# EAGLE schematic BUZZI-19c (EAGLE 4.15)

## Sheet 1 of 8
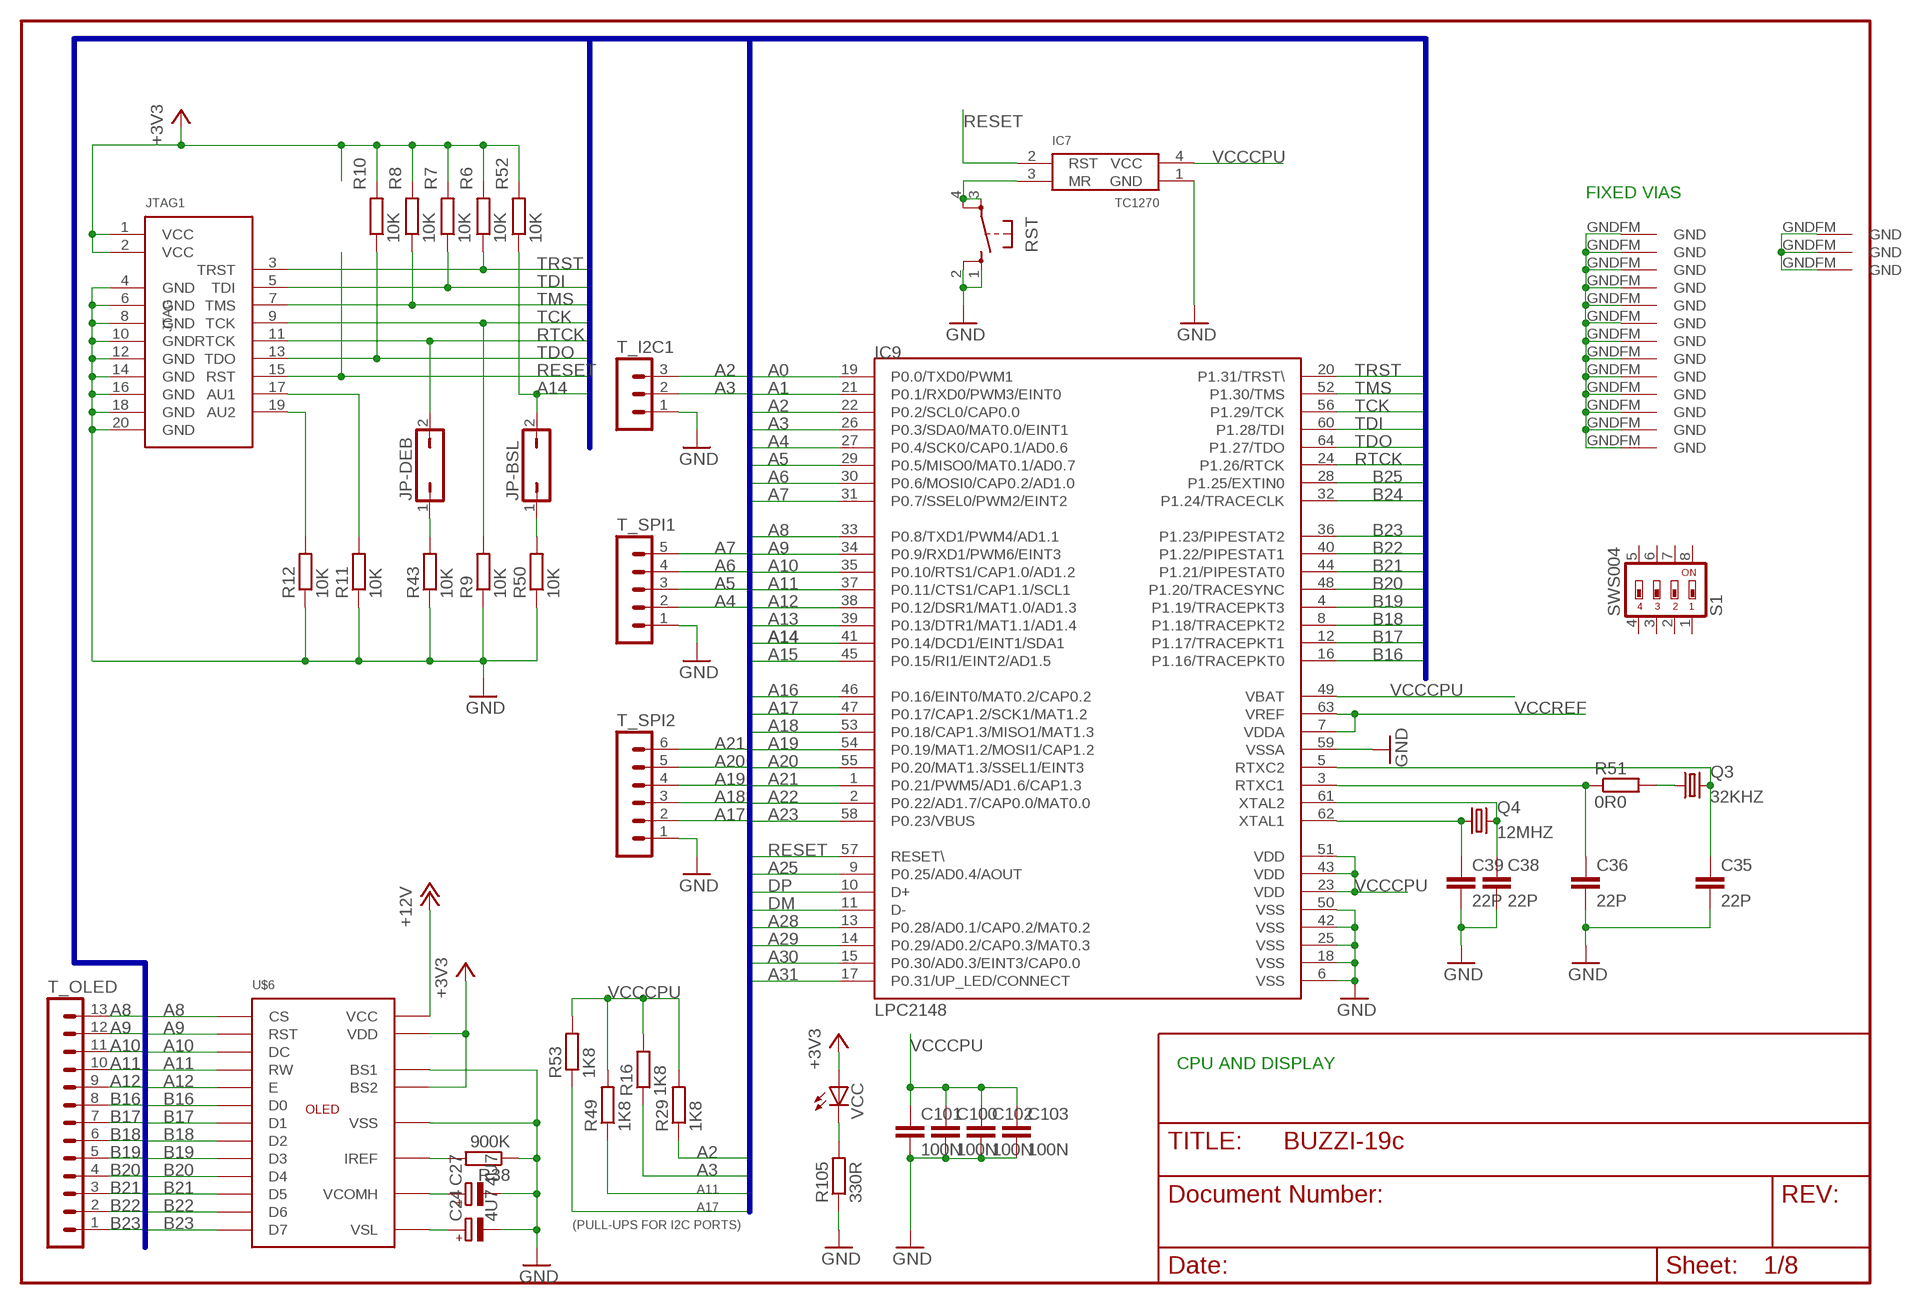
[diagram p0: schematic, sheet 1]

### Parts
$$U$9  STITCHVIA  [STITCHVIA]
$$U$11  STITCHVIA  [STITCHVIA]
C24  4U7  CPOL-EUCT3528  [CT3528]
C27  4U7  CPOL-EUCT3528  [CT3528]
C35  22P  C-EUC0805  [C0805]
C36  22P  C-EUC0805  [C0805]
C38  22P  C-EUC0805  [C0805]
C39  22P  C-EUC0805  [C0805]
C100  100N  C-EUC0805  [C0805]
C101  100N  C-EUC0805  [C0805]
C102  100N  C-EUC0805  [C0805]
C103  100N  C-EUC0805  [C0805]
IC7  TC1270  [SOT143R_INFINEON]
IC9  LPC2148  LPC2148FBD64  [TSQFP50P1200X1200X160-64N]
JP-BSL  JP1Q  [JP1]
JP-DEB  JP1Q  [JP1]
JTAG1  ARM-JTAG  [ML20L]
Q3  32KHZ  CRYTALTC26V  [TC26V]
Q4  12MHZ  CRYTALHC49UP  [HC49UP]
R6  10K  R-EU_M0805  [M0805]
R7  10K  R-EU_M0805  [M0805]
R8  10K  R-EU_M0805  [M0805]
R9  10K  R-EU_M0805  [M0805]
R10  10K  R-EU_M0805  [M0805]
R11  10K  R-EU_M0805  [M0805]
R12  10K  R-EU_M0805  [M0805]
R16  1K8  R-EU_M0805  [M0805]
R29  1K8  R-EU_M0805  [M0805]
R38  900K  R-EU_M0805  [M0805]
R43  10K  R-EU_M0805  [M0805]
R49  1K8  R-EU_M0805  [M0805]
R50  10K  R-EU_M0805  [M0805]
R51  0R0  R-EU_M0805  [M0805]
R52  10K  R-EU_M0805  [M0805]
R53  1K8  R-EU_M0805  [M0805]
R105  330R  R-EU_M0805  [M0805]
RST  10XX  [B3F-10XX]
S1  SWS004  [SMS-004]
T_I2C1  MA03-1  [MA03-1]
T_OLED  MA13-1  [MA13-1]
T_SPI1  MA05-1  [MA05-1]
T_SPI2  MA06-1  [MA06-1]
U$3  STITCHVIA  [STITCHVIA]
U$4  STITCHVIA  [STITCHVIA]
U$5  STITCHVIA  [STITCHVIA]
U$6  OLED_CALGARY_2  [OLED_CALGARY_INST]
U$7  STITCHVIA  [STITCHVIA]
U$8  STITCHVIA  [STITCHVIA]
U$10  STITCHVIA  [STITCHVIA]
U$12  STITCHVIA  [STITCHVIA]
U$13  STITCHVIA  [STITCHVIA]
U$14  STITCHVIA  [STITCHVIA]
U$15  STITCHVIA  [STITCHVIA]
U$16  STITCHVIA  [STITCHVIA]
U$17  STITCHVIA  [STITCHVIA]
U$18  STITCHVIA  [STITCHVIA]
U$19  STITCHVIA  [STITCHVIA]
VCC  LEDCHIP-LED0805  [CHIP-LED0805]

### Nets
+3V3: JTAG1.1(VCC) JTAG1.2(VCC) R6.2 R7.2 R8.2 R10.2 R52.2 U$6.P$19(BS2) U$6.P$21(VDD) VCC.A ; also sheet 2,5,7,8
+12V: U$6.P$2(VCC)
A0: IC9.19(P0.0/TXD0/PWM1)
A1: IC9.21(P0.1/RXD0/PWM3/EINT0) ; also sheet 4,7
A2: IC9.22(P0.2/SCL0/CAP0.0) R29.1 T_I2C1.3 ; also sheet 4,7
A3: IC9.26(P0.3/SDA0/MAT0.0/EINT1) R16.1 T_I2C1.2 ; also sheet 4,7
A4: IC9.27(P0.4/SCK0/CAP0.1/AD0.6) T_SPI1.2 ; also sheet 5,6
A5: IC9.29(P0.5/MISO0/MAT0.1/AD0.7) T_SPI1.3 ; also sheet 5,6
A6: IC9.30(P0.6/MOSI0/CAP0.2/AD1.0) T_SPI1.4 ; also sheet 5,6
A7: IC9.31(P0.7/SSEL0/PWM2/EINT2) T_SPI1.5 ; also sheet 5
A8: IC9.33(P0.8/TXD1/PWM4/AD1.1) T_OLED.13 U$6.P$17(CS)
A9: IC9.34(P0.9/RXD1/PWM6/EINT3) T_OLED.12 U$6.P$16(RST)
A10: IC9.35(P0.10/RTS1/CAP1.0/AD1.2) T_OLED.11 U$6.P$15(DC)
A11: IC9.37(P0.11/CTS1/CAP1.1/SCL1) R49.1 T_OLED.10 U$6.P$14(RW)
A12: IC9.38(P0.12/DSR1/MAT1.0/AD1.3) T_OLED.9 U$6.P$13(E)
A13: IC9.39(P0.13/DTR1/MAT1.1/AD1.4)
A14: IC9.41(P0.14/DCD1/EINT1/SDA1) JP-BSL.2 R52.1
A15: IC9.45(P0.15/RI1/EINT2/AD1.5) ; also sheet 6
A16: IC9.46(P0.16/EINT0/MAT0.2/CAP0.2) ; also sheet 4
A17: IC9.47(P0.17/CAP1.2/SCK1/MAT1.2) R53.1 T_SPI2.2 ; also sheet 4
A18: IC9.53(P0.18/CAP1.3/MISO1/MAT1.3) T_SPI2.3 ; also sheet 4
A19: IC9.54(P0.19/MAT1.2/MOSI1/CAP1.2) T_SPI2.4 ; also sheet 4
A20: IC9.55(P0.20/MAT1.3/SSEL1/EINT3) T_SPI2.5 ; also sheet 4
A21: IC9.1(P0.21/PWM5/AD1.6/CAP1.3) T_SPI2.6 ; also sheet 4
A22: IC9.2(P0.22/AD1.7/CAP0.0/MAT0.0)
A23: IC9.58(P0.23/VBUS) ; also sheet 2
A25: IC9.9(P0.25/AD0.4/AOUT)
A28: IC9.13(P0.28/AD0.1/CAP0.2/MAT0.2) ; also sheet 4
A29: IC9.14(P0.29/AD0.2/CAP0.3/MAT0.3) ; also sheet 4
A30: IC9.15(P0.30/AD0.3/EINT3/CAP0.0) ; also sheet 4
A31: IC9.17(P0.31/UP_LED/CONNECT) ; also sheet 2
B16: IC9.16(P1.16/TRACEPKT0) T_OLED.8 U$6.P$12(D0)
B17: IC9.12(P1.17/TRACEPKT1) T_OLED.7 U$6.P$11(D1)
B18: IC9.8(P1.18/TRACEPKT2) T_OLED.6 U$6.P$10(D2)
B19: IC9.4(P1.19/TRACEPKT3) T_OLED.5 U$6.P$9(D3)
B20: IC9.48(P1.20/TRACESYNC) T_OLED.4 U$6.P$8(D4)
B21: IC9.44(P1.21/PIPESTAT0) T_OLED.3 U$6.P$7(D5)
B22: IC9.40(P1.22/PIPESTAT1) T_OLED.2 U$6.P$6(D6)
B23: IC9.36(P1.23/PIPESTAT2) T_OLED.1 U$6.P$5(D7)
B24: IC9.32(P1.24/TRACECLK)
B25: IC9.28(P1.25/EXTIN0)
DM: IC9.11(D-) ; also sheet 2
DP: IC9.10(D+) ; also sheet 2
GND: C24.- C27.- C35.2 C36.2 C38.2 C39.2 C100.2 C101.2 C102.2 C103.2 IC7.1(GND) IC9.6(VSS) IC9.18(VSS) IC9.25(VSS) IC9.42(VSS) IC9.50(VSS) IC9.59(VSSA) JTAG1.4(GND) JTAG1.6(GND) JTAG1.8(GND) JTAG1.10(GND) JTAG1.12(GND) JTAG1.14(GND) JTAG1.16(GND) JTAG1.18(GND) JTAG1.20(GND) R9.1 R11.1 R12.1 R38.1 R43.1 R50.1 R105.1 RST.1 RST.2 T_I2C1.1 T_SPI1.1 T_SPI2.1 U$5.GNDFM(GND) U$6.P$20(BS1) U$6.P$29(VSS) U$7.GNDFM(GND) U$17.GNDFM(GND) ; also sheet 2,5,6,7,8
GNDFM: $$U$9.GNDFM(GND) $$U$11.GNDFM(GND) U$3.GNDFM(GND) U$4.GNDFM(GND) U$8.GNDFM(GND) U$10.GNDFM(GND) U$12.GNDFM(GND) U$13.GNDFM(GND) U$14.GNDFM(GND) U$15.GNDFM(GND) U$16.GNDFM(GND) U$18.GNDFM(GND) U$19.GNDFM(GND) ; also sheet 4,8
JBSL: JP-BSL.1 R50.2
JDEB: JP-DEB.1 R43.2
JTAG17: JTAG1.17(AU1) R11.2
JTAG19: JTAG1.19(AU2) R12.2
MRSWITCH: IC7.3(MR) RST.3 RST.4
N$44: R38.2 U$6.P$4(IREF)
N$45: C27.+ U$6.P$3(VCOMH)
N$46: C24.+ U$6.P$30(VSL)
RESET: IC7.2(RST) IC9.57(RESET\) JTAG1.15(RST)
RTCK: IC9.24(P1.26/RTCK) JP-DEB.2 JTAG1.11(RTCK)
RX1: C36.1 IC9.3(RTXC1) R51.1
RX2: C35.1 IC9.5(RTXC2) Q3.2
RX3: Q3.1 R51.2
TCK: IC9.56(P1.29/TCK) JTAG1.9(TCK) R9.2
TDI: IC9.60(P1.28/TDI) JTAG1.5(TDI) R7.1
TDO: IC9.64(P1.27/TDO) JTAG1.13(TDO) R10.1
TMS: IC9.52(P1.30/TMS) JTAG1.7(TMS) R8.1
TRST: IC9.20(P1.31/TRST\) JTAG1.3(TRST) R6.1
VCCCPU: C100.1 C101.1 C102.1 C103.1 IC7.4(VCC) IC9.23(VDD) IC9.43(VDD) IC9.49(VBAT) IC9.51(VDD) R16.2 R29.2 R49.2 R53.2 ; also sheet 8
VCCLED: R105.2 VCC.C
VCCREF: IC9.7(VDDA) IC9.63(VREF) ; also sheet 8
X1: C39.1 IC9.62(XTAL1) Q4.1
X2: C38.1 IC9.61(XTAL2) Q4.2
Unconnected: S1.1 S1.2 S1.3 S1.4 S1.5 S1.6 S1.7 S1.8

### Buses
ARM7:A[0..31],B[0..31],RESET,DP,DM,TRST,TMS,TCK,TDI,TDO,RTCK

### Notes on the sheet
- FIXED VIAS
- CPU AND DISPLAY
- (PULL-UPS FOR I2C PORTS)

## Sheet 2 of 8
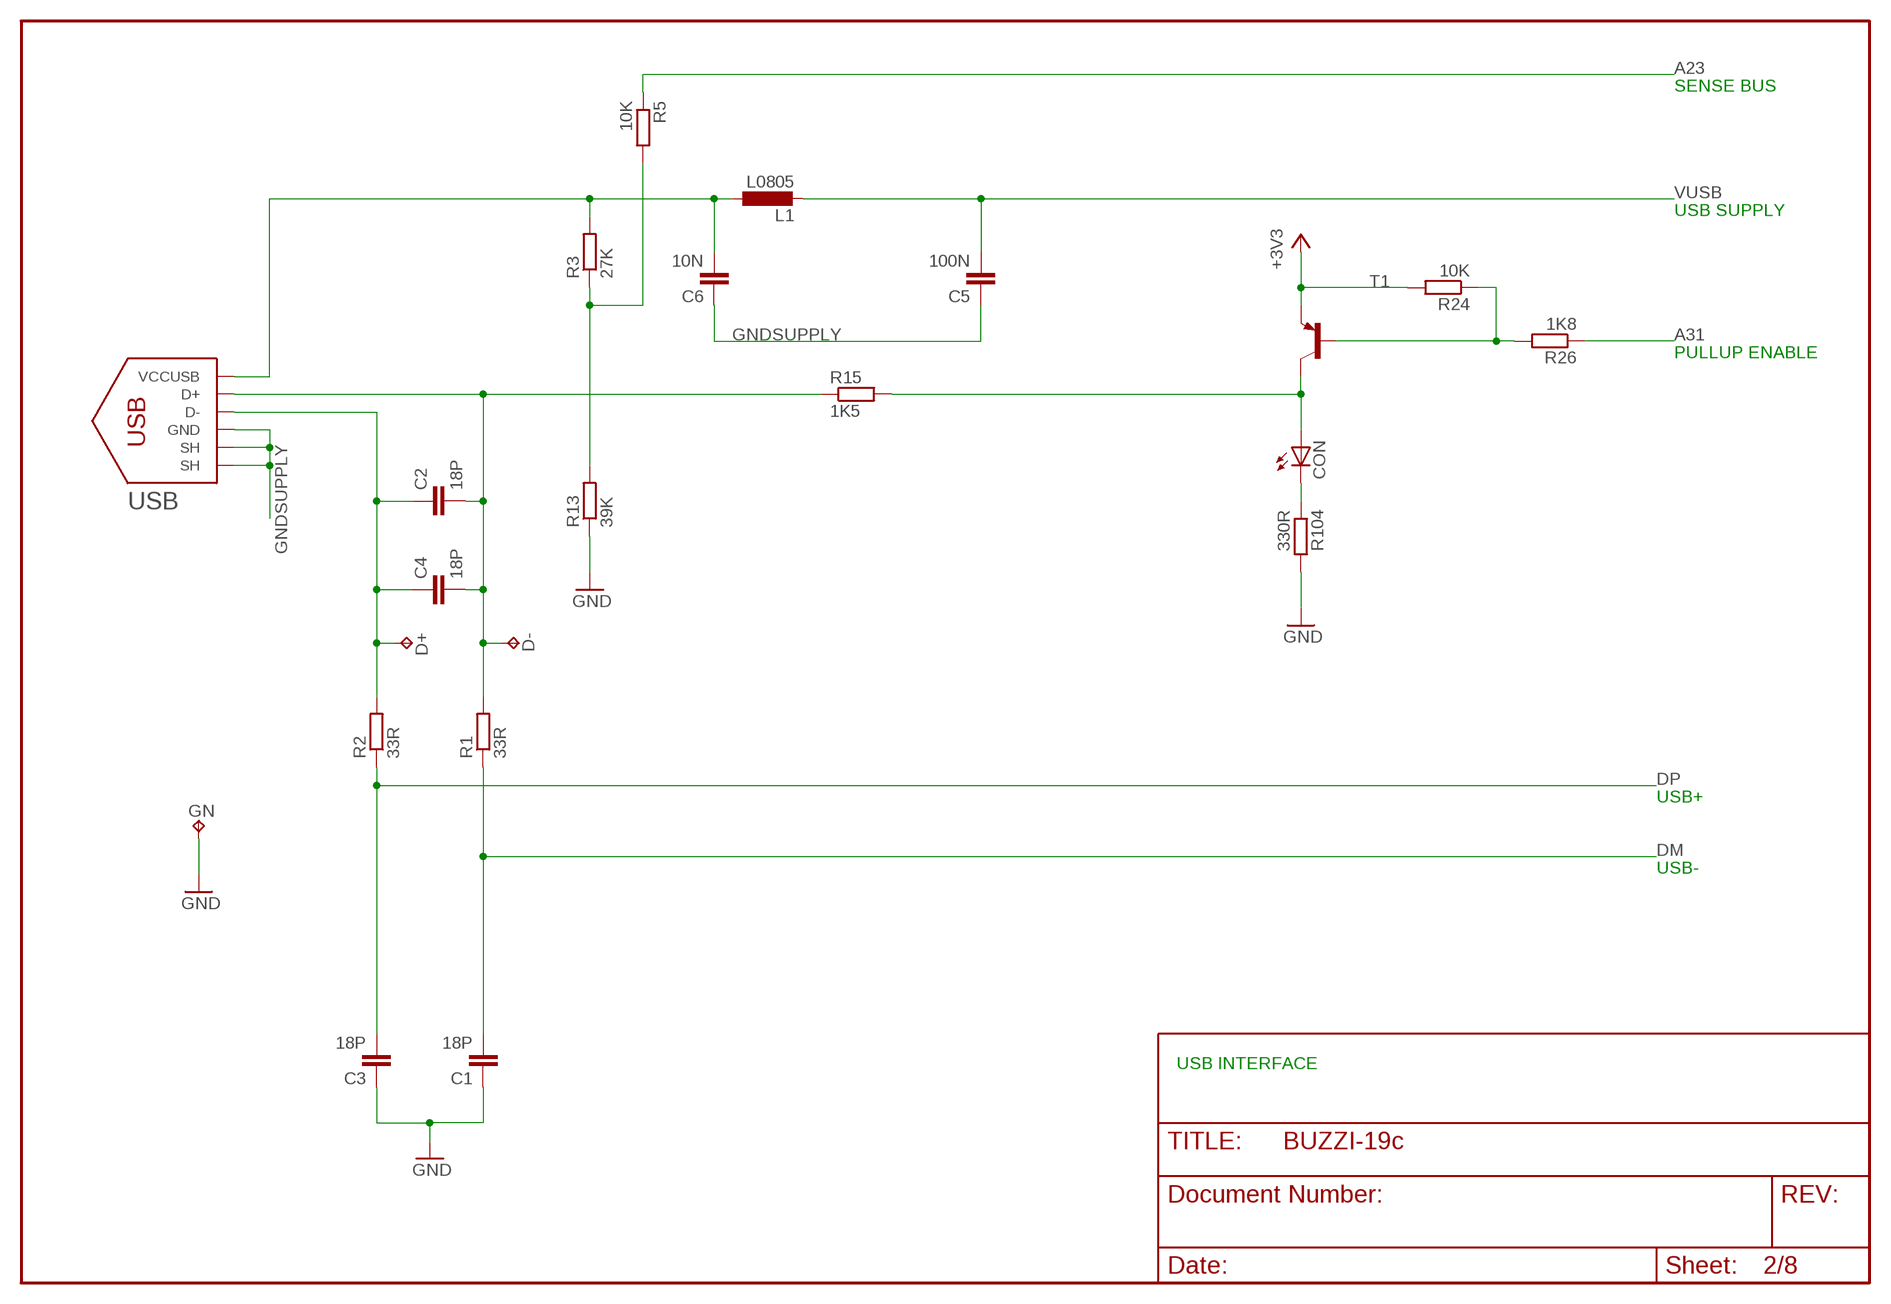
[diagram p1: schematic, sheet 2]

### Parts
C1  18P  C-EUC0805  [C0805]
C2  18P  C-EUC0805  [C0805]
C3  18P  C-EUC0805  [C0805]
C4  18P  C-EUC0805  [C0805]
C5  100N  C-EUC0805  [C0805]
C6  10N  C-EUC0805  [C0805]
CON  LEDCHIP-LED0805  [CHIP-LED0805]
D+  TPPAD1-13  [P1-13]
D-  TPPAD1-13  [P1-13]
GN  TPPAD1-13  [P1-13]
L1  L0805  [C0805]
R1  33R  R-EU_M0805  [M0805]
R2  33R  R-EU_M0805  [M0805]
R3  27K  R-EU_M0805  [M0805]
R5  10K  R-EU_M0805  [M0805]
R13  39K  R-EU_M0805  [M0805]
R15  1K5  R-EU_M0805  [M0805]
R24  10K  R-EU_M0805  [M0805]
R26  1K8  R-EU_M0805  [M0805]
R104  330R  R-EU_M0805  [M0805]
T1  BC857A-PNP-SOT23-BEC  [SOT23-BEC]
USB  USBCONNMINI-B-HOLE  [USB-MB-H]

### Nets
+3V3: R24.2 T1.E ; also sheet 1,5,7,8
A23: R5.1 ; also sheet 1
A31: R26.1 ; also sheet 1
CONLED: CON.C R104.1
D+: C2.1 C4.1 D+.1(TP) R2.2 USB.D-
D+PULLUP1: CON.A R15.2 T1.C
D+PULLUP2: R24.1 R26.2 T1.B
D-: C2.2 C4.2 D-.1(TP) R1.2 R15.1 USB.D+
DM: C1.2 R1.1 ; also sheet 1
DP: C3.2 R2.1 ; also sheet 1
GND: C1.1 C3.1 GN.1(TP) R13.1 R104.2 ; also sheet 1,5,6,7,8
GNDSUPPLY [supply]: C5.1 C6.1 USB.GND USB.GND@1(SH) USB.GND@2(SH) ; also sheet 8
USBSENSE: R3.1 R5.2 R13.2
VCCUSB1 [supply]: C6.2 L1.1 R3.2 USB.VBUS(VCCUSB)
VUSB [supply]: C5.2 L1.2 ; also sheet 8

### Notes on the sheet
- SENSE BUS
- USB SUPPLY
- PULLUP ENABLE
- USB+
- USB-
- USB INTERFACE

## Sheet 3 of 8
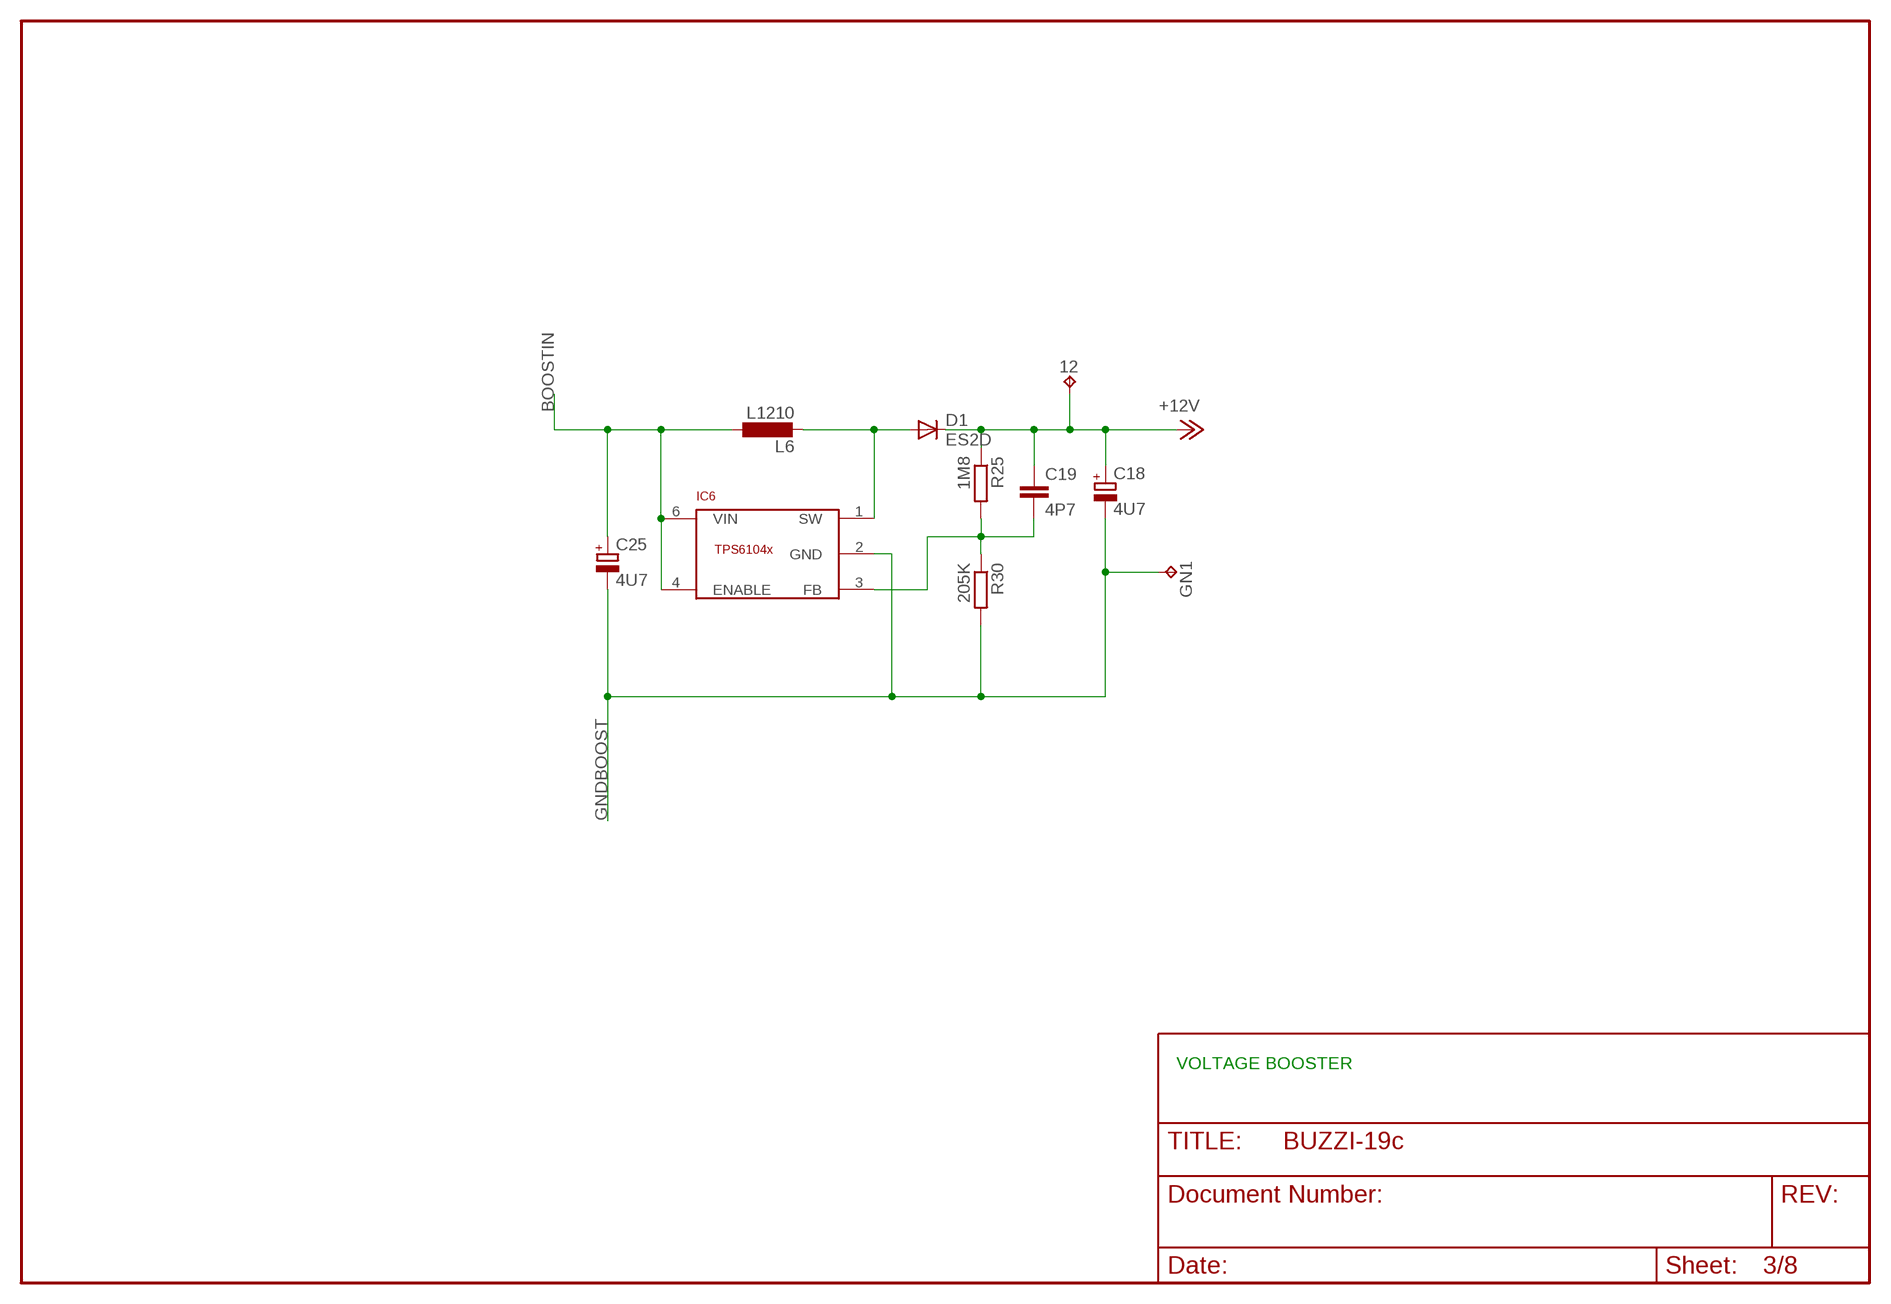
[diagram p2: schematic, sheet 3]

### Parts
12  TPPAD1-13  [P1-13]
C18  4U7  CPOL-EUCT3528  [CT3528]
C19  4P7  C-EUC0805  [C0805]
C25  4U7  CPOL-EUCT3528  [CT3528]
D1  ES2D  [SMB]
GN1  TPPAD1-13  [P1-13]
IC6  TPS6104X  [SOT23-6L]
L6  L1210  [C1210]
R25  1M8  R-EU_M0805  [M0805]
R30  205K  R-EU_M0805  [M0805]

### Nets
12: 12.1(TP) C18.+ C19.1 D1.C R25.1 ; supply symbol labelled +12V
BOOST2: D1.A IC6.1(SW) L6.2
BOOST3: C19.2 IC6.3(FB) R25.2 R30.1
BOOSTIN: C25.+ IC6.4(ENABLE) IC6.6(VIN) L6.1 ; also sheet 8
GNDBOOST [supply]: C18.- C25.- GN1.1(TP) IC6.2(GND) R30.2 ; also sheet 8

### Notes on the sheet
- VOLTAGE BOOSTER

## Sheet 4 of 8
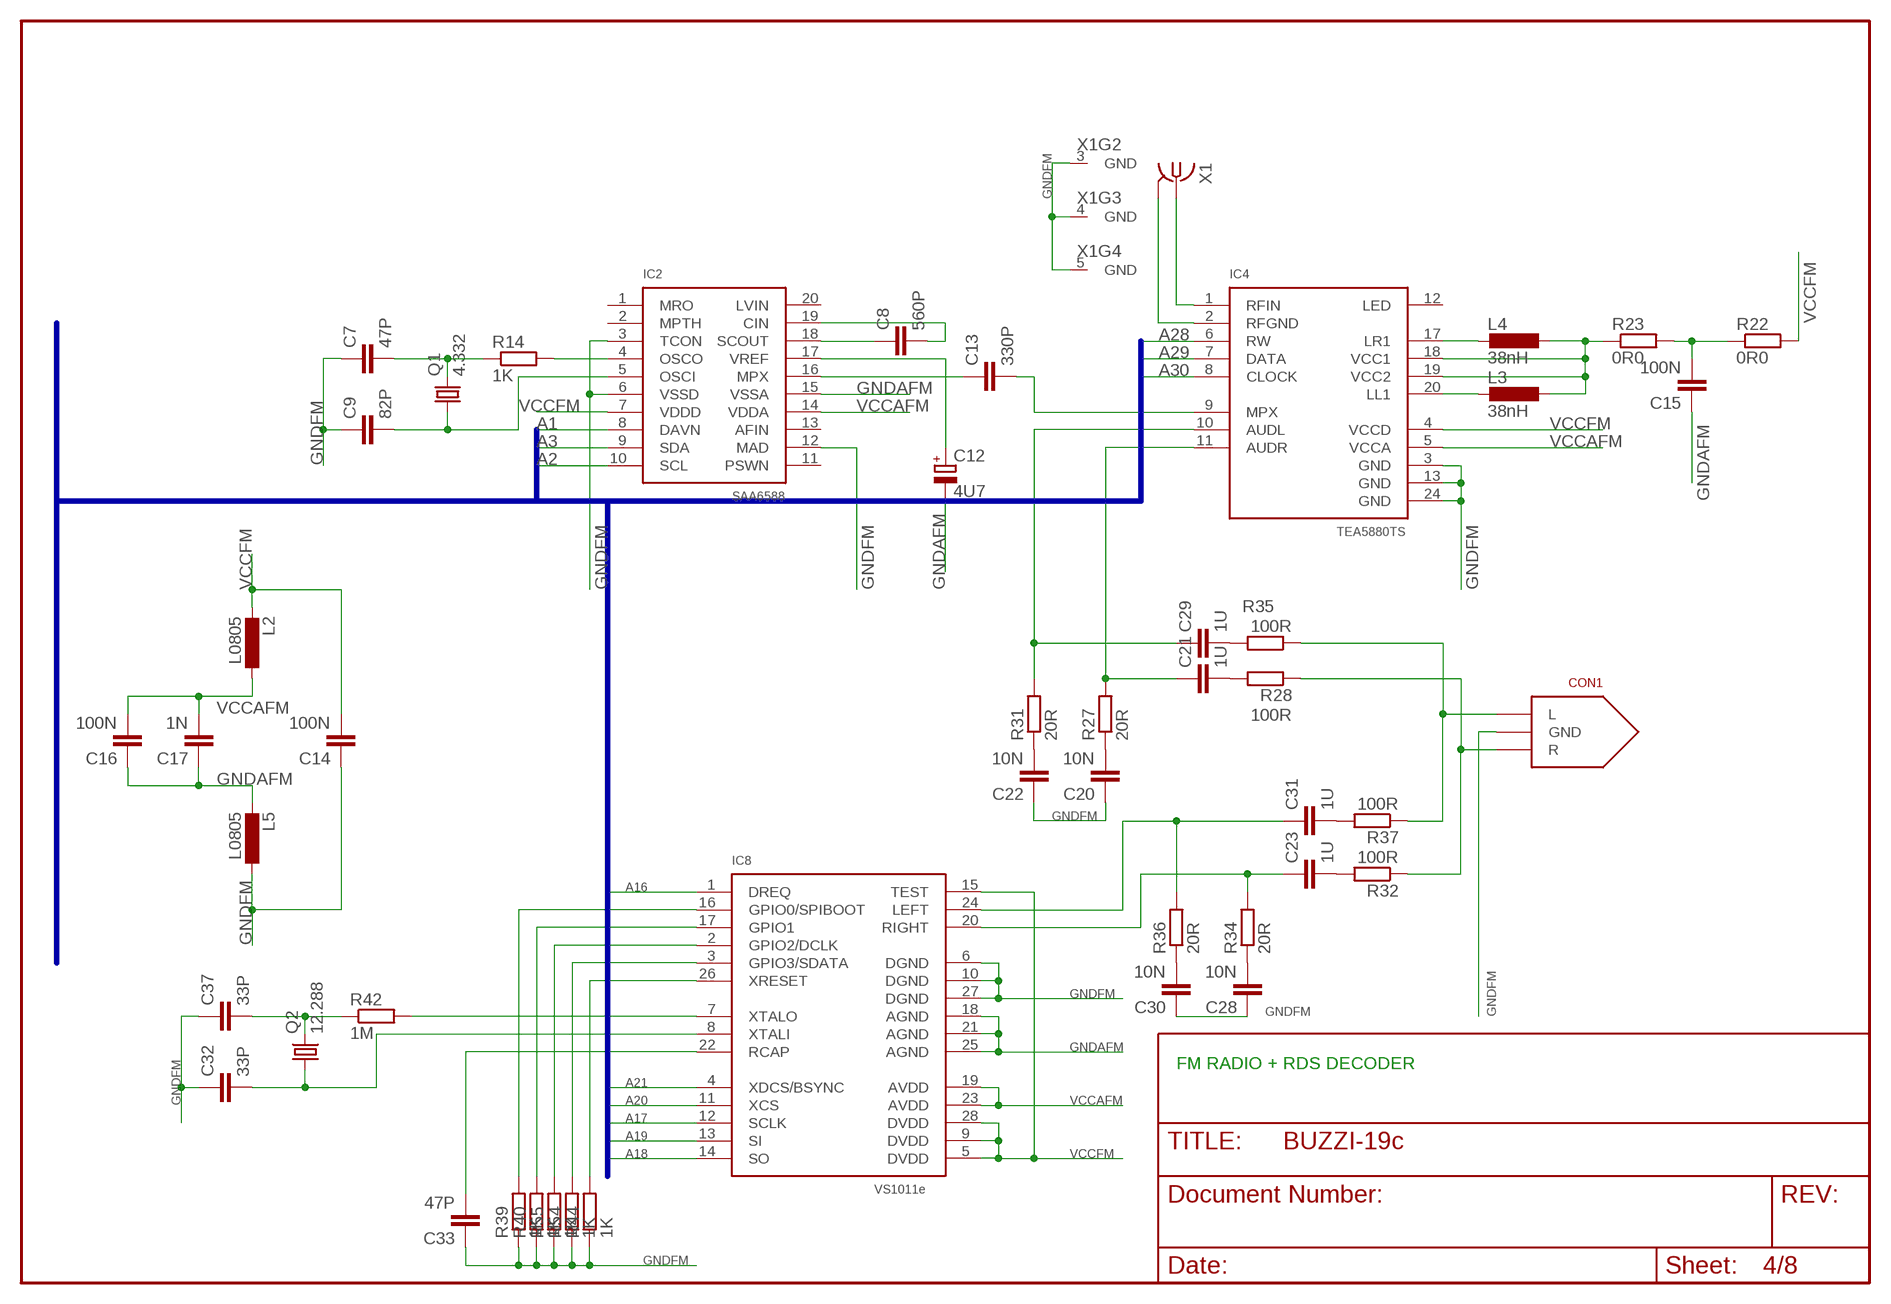
[diagram p3: schematic, sheet 4]

### Parts
C7  47P  C-EUC0805  [C0805]
C8  560P  C-EUC0805  [C0805]
C9  82P  C-EUC0805  [C0805]
C12  4U7  CPOL-EUCT3528  [CT3528]
C13  330P  C-EUC0805  [C0805]
C14  100N  C-EUC0805  [C0805]
C15  100N  C-EUC0805  [C0805]
C16  100N  C-EUC0805  [C0805]
C17  1N  C-EUC0805  [C0805]
C20  10N  C-EUC0805  [C0805]
C21  1U  C-EUC0805  [C0805]
C22  10N  C-EUC0805  [C0805]
C23  1U  C-EUC0805  [C0805]
C28  10N  C-EUC0805  [C0805]
C29  1U  C-EUC0805  [C0805]
C30  10N  C-EUC0805  [C0805]
C31  1U  C-EUC0805  [C0805]
C32  33P  C-EUC0805  [C0805]
C33  47P  C-EUC0805  [C0805]
C37  33P  C-EUC0805  [C0805]
CON1  STEREOKLINKE  [STEREOKLINKE_3,5_SMD]
IC2  SAA6588  [SO20W]
IC4  TEA5880TS  [SSOP24]
IC8  VS1011E  [SOP28]
L2  L0805  [C0805]
L3  38nH  L0805  [C0805]
L4  38nH  L0805  [C0805]
L5  L0805  [C0805]
Q1  4.332  CRYTALHC49S  [HC49/S]
Q2  12.288  CRYTALHC49S  [HC49/S]
R14  1K  R-EU_M0805  [M0805]
R22  0R0  R-EU_M0805  [M0805]
R23  0R0  R-EU_M0805  [M0805]
R27  20R  R-EU_M0805  [M0805]
R28  100R  R-EU_M0805  [M0805]
R31  20R  R-EU_M0805  [M0805]
R32  100R  R-EU_M0805  [M0805]
R34  20R  R-EU_M0805  [M0805]
R35  100R  R-EU_M0805  [M0805]
R36  20R  R-EU_M0805  [M0805]
R37  100R  R-EU_M0805  [M0805]
R39  1K  R-EU_M0805  [M0805]
R40  1K  R-EU_M0805  [M0805]
R42  1M  R-EU_M0805  [M0805]
R44  1K  R-EU_M0805  [M0805]
R54  1K  R-EU_M0805  [M0805]
R55  1K  R-EU_M0805  [M0805]
X1  BU-SMB-V  [BU-SMB-V]

### Nets
A1: IC2.8(DAVN) ; also sheet 1,7
A2: IC2.10(SCL) ; also sheet 1,7
A3: IC2.9(SDA) ; also sheet 1,7
A16: IC8.1(DREQ) ; also sheet 1
A17: IC8.12(SCLK) ; also sheet 1
A18: IC8.14(SO) ; also sheet 1
A19: IC8.13(SI) ; also sheet 1
A20: IC8.11(XCS) ; also sheet 1
A21: IC8.4(XDCS/BSYNC) ; also sheet 1
A28: IC4.6(RW) ; also sheet 1
A29: IC4.7(DATA) ; also sheet 1
A30: IC4.8(CLOCK) ; also sheet 1
GNDAFM: C12.- C15.1 C16.1 C17.1 IC2.15(VSSA) IC8.18(AGND) IC8.21(AGND) IC8.25(AGND) L5.2
GNDFM: C7.1 C9.1 C14.1 C20.1 C22.1 C28.1 C30.1 C32.1 C33.1 C37.1 CON1.P$G(GND) IC2.3(TCON) IC2.6(VSSD) IC2.12(MAD) IC4.3(GND) IC4.13(GND) IC4.24(GND) IC8.6(DGND) IC8.10(DGND) IC8.27(DGND) L5.1 R39.1 R40.1 R44.1 R54.1 R55.1 X1.3(GND) X1.4(GND) X1.5(GND) ; also sheet 1,8
N$1: C13.1 IC2.16(MPX)
N$2: C21.1 IC4.11(AUDR) R27.2
N$3: C29.1 IC4.10(AUDL) R31.2
N$10: IC2.4(OSCO) R14.2
N$11: C7.2 Q1.2 R14.1
N$12: C9.2 IC2.5(OSCI) Q1.1
N$13: C8.1 IC2.18(SCOUT)
N$14: C8.2 IC2.19(CIN)
N$15: C13.2 IC4.9(MPX)
N$16: C12.+ IC2.17(VREF)
N$17: IC4.17(LR1) L4.2
N$18: IC4.20(LL1) L3.2
N$20: C15.2 R22.1 R23.2
N$21: IC8.26(XRESET) R44.2
N$22: IC4.1(RFIN) X1.1
N$23: IC4.2(RFGND) X1.2(GND)
N$24: IC8.3(GPIO3/SDATA) R54.2
N$25: IC8.2(GPIO2/DCLK) R55.2
N$26: IC8.17(GPIO1) R40.2
N$27: C37.2 Q2.2 R42.1
N$28: C32.2 IC8.8(XTALI) Q2.1
N$29: IC8.7(XTALO) R42.2
N$30: C33.2 IC8.22(RCAP)
N$31: IC8.16(GPIO0/SPIBOOT) R39.2
N$32: C30.2 R36.1
N$33: C28.2 R34.1
N$34: C22.2 R31.1
N$35: C20.2 R27.1
N$36: C29.2 R35.2
N$37: C21.2 R28.2
N$38: C31.2 R37.2
N$39: C23.2 R32.2
N$40: C31.1 IC8.24(LEFT) R36.2
N$41: C23.1 IC8.20(RIGHT) R34.2
N$42: CON1.P$L(L) R35.1 R37.1
N$43: CON1.P$R(R) R28.1 R32.1
OSCGND: IC4.18(VCC1) IC4.19(VCC2) L3.1 L4.1 R23.1
VCCAFM: C16.2 C17.2 IC2.14(VDDA) IC4.5(VCCA) IC8.19(AVDD) IC8.23(AVDD) L2.1
VCCFM: C14.2 IC2.7(VDDD) IC4.4(VCCD) IC8.5(DVDD) IC8.9(DVDD) IC8.15(TEST) IC8.28(DVDD) L2.2 R22.2 ; also sheet 8
Unconnected: IC2.1(MRO) IC2.2(MPTH) IC2.11(PSWN) IC2.13(AFIN) IC2.20(LVIN) IC4.12(LED)

### Buses
ARM7:A[0..31],B[0..31],RESET,DP,DM,TRST,TMS,TCK,TDI,TDO,RTCK

### Notes on the sheet
- FM RADIO + RDS DECODER

## Sheet 5 of 8
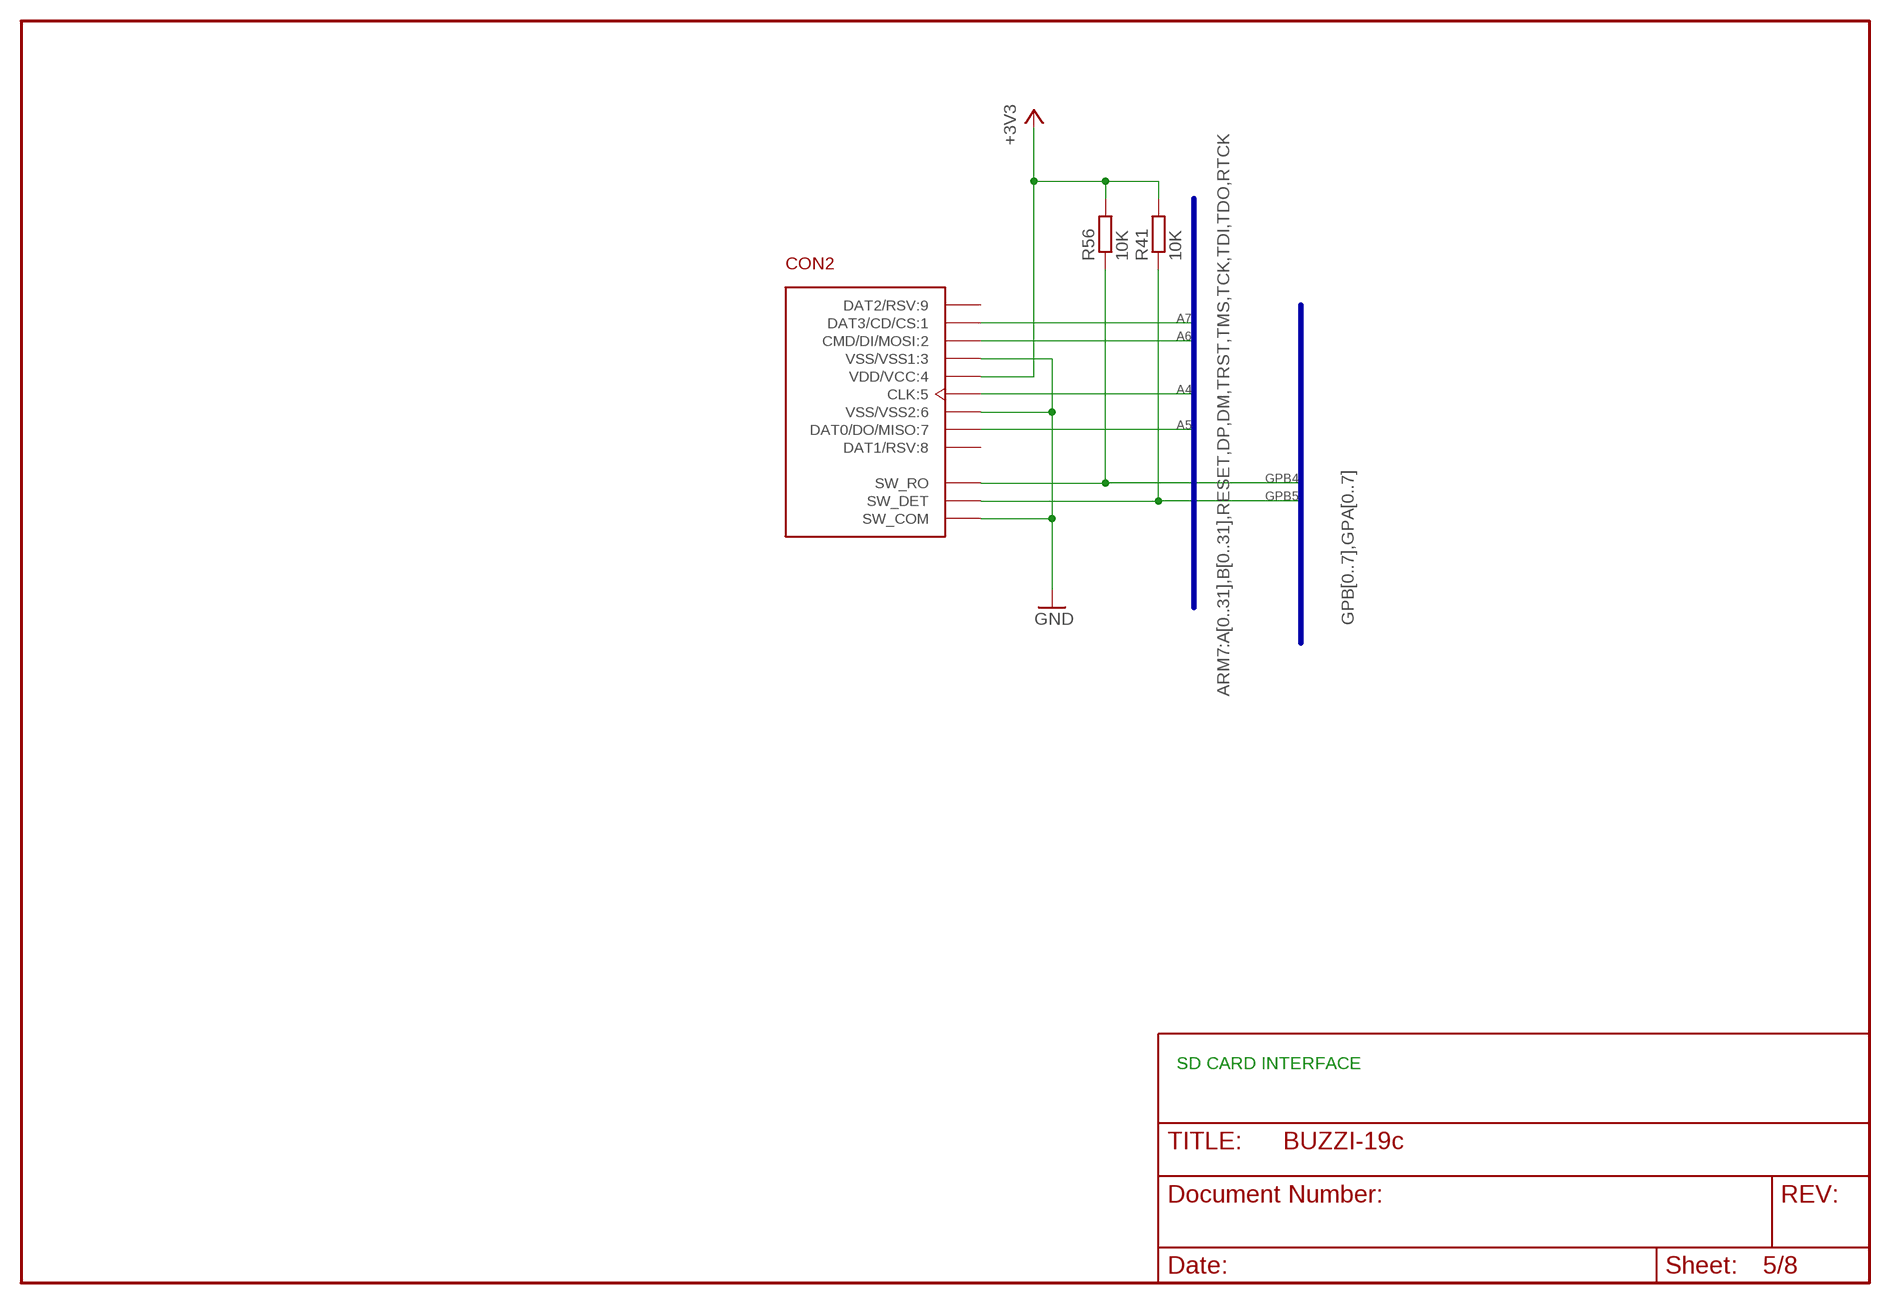
[diagram p4: schematic, sheet 5]

### Parts
CON2  SDSLOT  [HIROSE_DM1A]
R41  10K  R-EU_M0805  [M0805]
R56  10K  R-EU_M0805  [M0805]

### Nets
+3V3: CON2.P$4(VDD/VCC:4) R41.2 R56.2 ; also sheet 1,2,7,8
A4: CON2.P$5(CLK:5) ; also sheet 1,6
A5: CON2.P$7(DAT0/DO/MISO:7) ; also sheet 1,6
A6: CON2.P$2(CMD/DI/MOSI:2) ; also sheet 1,6
A7: CON2.P$1(DAT3/CD/CS:1) ; also sheet 1
GND: CON2.P$3(VSS/VSS1:3) CON2.P$6(VSS/VSS2:6) CON2.P$SWGND(SW_COM) ; also sheet 1,2,6,7,8
GPB4: CON2.P$SWRO(SW_RO) R56.1 ; also sheet 7
GPB5: CON2.P$SWDET(SW_DET) R41.1 ; also sheet 7
Unconnected: CON2.P$8(DAT1/RSV:8) CON2.P$9(DAT2/RSV:9)

### Buses
ARM7:A[0..31],B[0..31],RESET,DP,DM,TRST,TMS,TCK,TDI,TDO,RTCK
GPB[0..7],GPA[0..7]

### Notes on the sheet
- SD CARD INTERFACE

## Sheet 6 of 8
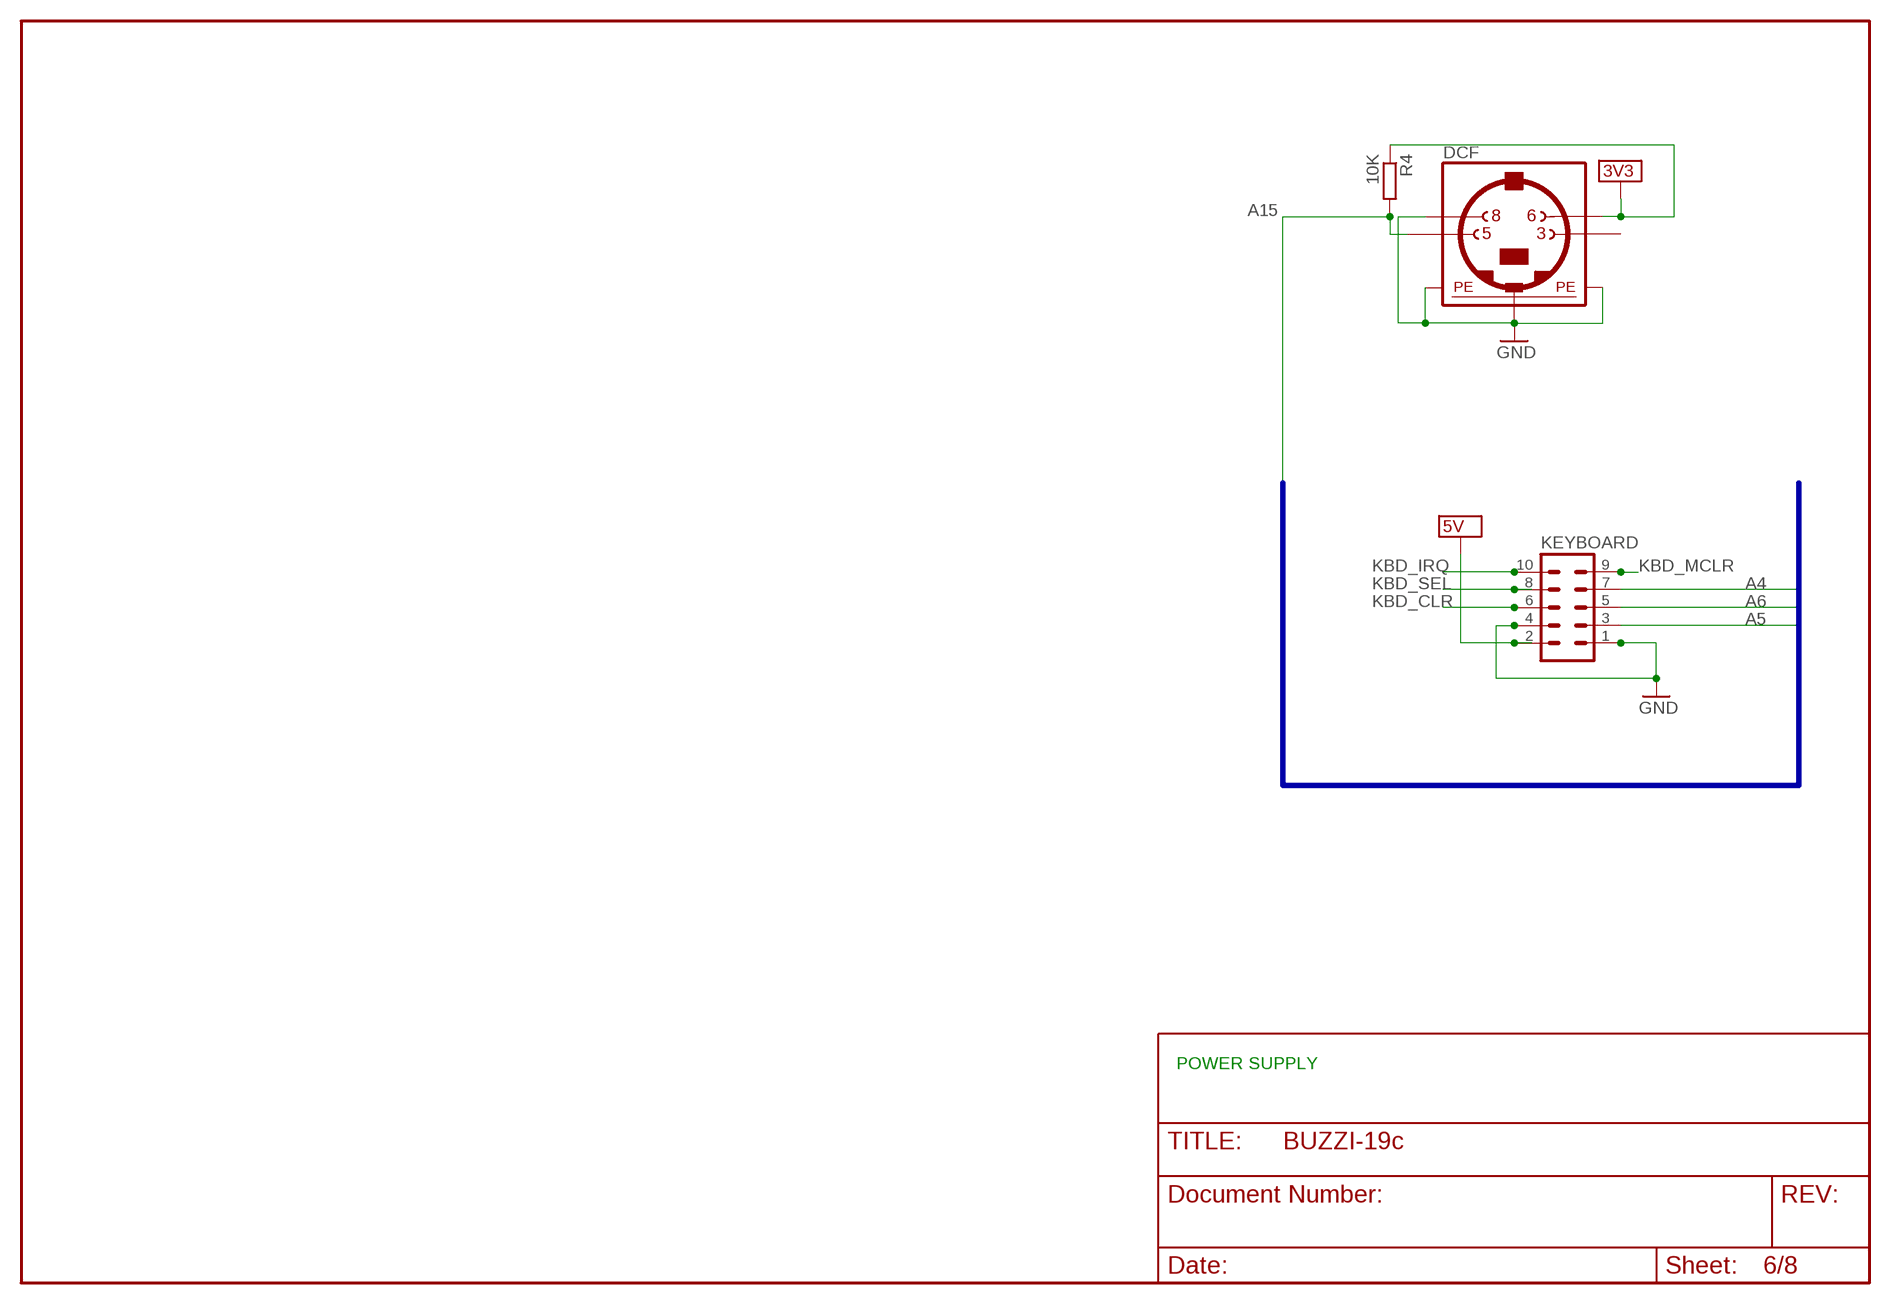
[diagram p5: schematic, sheet 6]

### Parts
DCF  MINI_DIN_4  [M_DIN4]
KEYBOARD  ML10  [ML10]
R4  10K  R-EU_M0805  [M0805]

### Nets
3V3: DCF.6 R4.1 ; supply symbol labelled SUPPLY3V3
5V [supply]: KEYBOARD.2 ; supply symbol labelled SUPPLY5V
A4: KEYBOARD.7 ; also sheet 1,5
A5: KEYBOARD.3 ; also sheet 1,5
A6: KEYBOARD.5 ; also sheet 1,5
A15: DCF.5 R4.2 ; also sheet 1
GND: DCF.8 DCF.SH1(PE1) DCF.SH2(PE2) DCF.SH3(PE3) KEYBOARD.1 KEYBOARD.4 ; also sheet 1,2,5,7,8
KBD_CLR: KEYBOARD.6
KBD_IRQ: KEYBOARD.10
KBD_MCLR: KEYBOARD.9
KBD_SEL: KEYBOARD.8
Unconnected: DCF.3

### Buses
ARM7:A[0..31],B[0..31],RESET,DP,DM,TRST,TMS,TCK,TDI,TDO,RTCK

### Notes on the sheet
- POWER SUPPLY

## Sheet 7 of 8
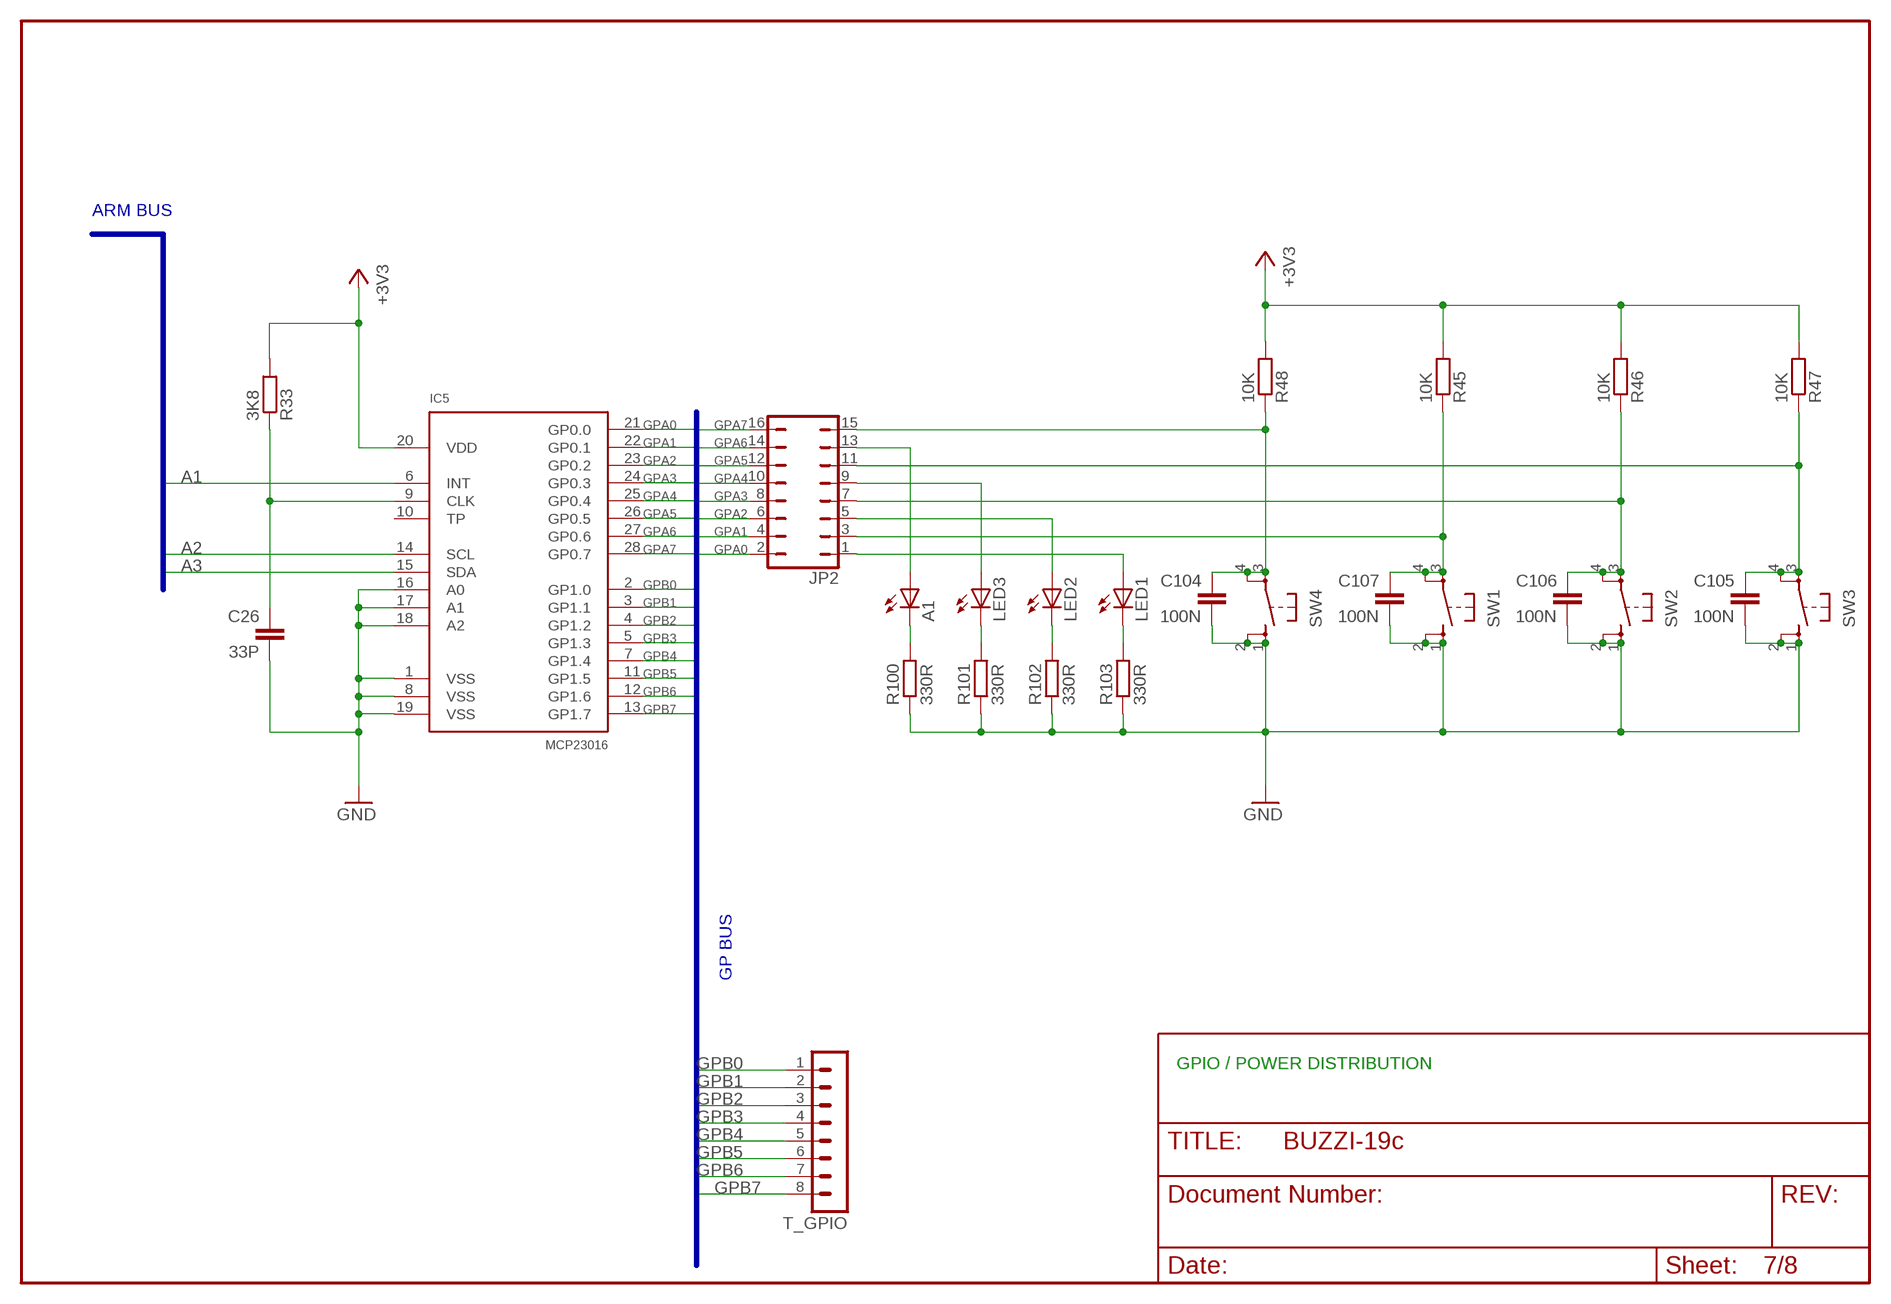
[diagram p6: schematic, sheet 7]

### Parts
A1  LEDCHIP-LED0805  [CHIP-LED0805]
C26  33P  C-EUC0805  [C0805]
C104  100N  C-EUC0805  [C0805]
C105  100N  C-EUC0805  [C0805]
C106  100N  C-EUC0805  [C0805]
C107  100N  C-EUC0805  [C0805]
IC5  MCP23016  [SSOP28]
JP2  JP8Q  [JP8Q]
LED1  LEDCHIP-LED0805  [CHIP-LED0805]
LED2  LEDCHIP-LED0805  [CHIP-LED0805]
LED3  LEDCHIP-LED0805  [CHIP-LED0805]
R33  3K8  R-EU_M0805  [M0805]
R45  10K  R-EU_M0805  [M0805]
R46  10K  R-EU_M0805  [M0805]
R47  10K  R-EU_M0805  [M0805]
R48  10K  R-EU_M0805  [M0805]
R100  330R  R-EU_M0805  [M0805]
R101  330R  R-EU_M0805  [M0805]
R102  330R  R-EU_M0805  [M0805]
R103  330R  R-EU_M0805  [M0805]
SW1  10XX  [B3F-10XX]
SW2  10XX  [B3F-10XX]
SW3  10XX  [B3F-10XX]
SW4  10XX  [B3F-10XX]
T_GPIO  MA08-1  [MA08-1]

### Nets
+3V3: IC5.20(VDD) R33.2 R45.2 R46.2 R47.2 R48.2 ; also sheet 1,2,5,8
A1: IC5.6(INT) ; also sheet 1,4
A1LED4: LED2.C R102.2
A1LED5: LED3.C R101.2
A2: IC5.14(SCL) ; also sheet 1,4
A3: IC5.15(SDA) ; also sheet 1,4
B25KEY1: C107.1 JP2.3 R45.1 SW1.3 SW1.4
B25KEY2: C106.1 JP2.7 R46.1 SW2.3 SW2.4
B25KEY3: C105.1 JP2.11 R47.1 SW3.3 SW3.4
B25KEY4: C104.1 JP2.15 R48.1 SW4.3 SW4.4
GND: C26.2 C104.2 C105.2 C106.2 C107.2 IC5.1(VSS) IC5.8(VSS) IC5.16(A0) IC5.17(A1) IC5.18(A2) IC5.19(VSS) R100.1 R101.1 R102.1 R103.1 SW1.1 SW1.2 SW2.1 SW2.2 SW3.1 SW3.2 SW4.1 SW4.2 ; also sheet 1,2,5,6,8
GPA0: IC5.21(GP0.0) JP2.2
GPA1: IC5.22(GP0.1) JP2.4
GPA2: IC5.23(GP0.2) JP2.6
GPA3: IC5.24(GP0.3) JP2.8
GPA4: IC5.25(GP0.4) JP2.10
GPA5: IC5.26(GP0.5) JP2.12
GPA6: IC5.27(GP0.6) JP2.14
GPA7: IC5.28(GP0.7) JP2.16
GPB0: IC5.2(GP1.0) T_GPIO.1 ; also sheet 8
GPB1: IC5.3(GP1.1) T_GPIO.2 ; also sheet 8
GPB2: IC5.4(GP1.2) T_GPIO.3 ; also sheet 8
GPB3: IC5.5(GP1.3) T_GPIO.4 ; also sheet 8
GPB4: IC5.7(GP1.4) T_GPIO.5 ; also sheet 5
GPB5: IC5.11(GP1.5) T_GPIO.6 ; also sheet 5
GPB6: IC5.12(GP1.6) T_GPIO.7
GPB7: IC5.13(GP1.7) T_GPIO.8
LED1: LED1.C R103.2
LED4: A1.C R100.2
N$5: JP2.1 LED1.A
N$6: JP2.5 LED2.A
N$7: JP2.9 LED3.A
N$8: A1.A JP2.13
N$9: C26.1 IC5.9(CLK) R33.1
Unconnected: IC5.10(TP)

### Buses
ARM7:A[0..31],B[0..31],RESET,DP,DM,TRST,TMS,TCK,TDI,TDO,RTCK
GPB[0..7],GPA[0..7]

### Notes on the sheet
- ARM BUS
- GP BUS
- GPIO / POWER DISTRIBUTION

## Sheet 8 of 8
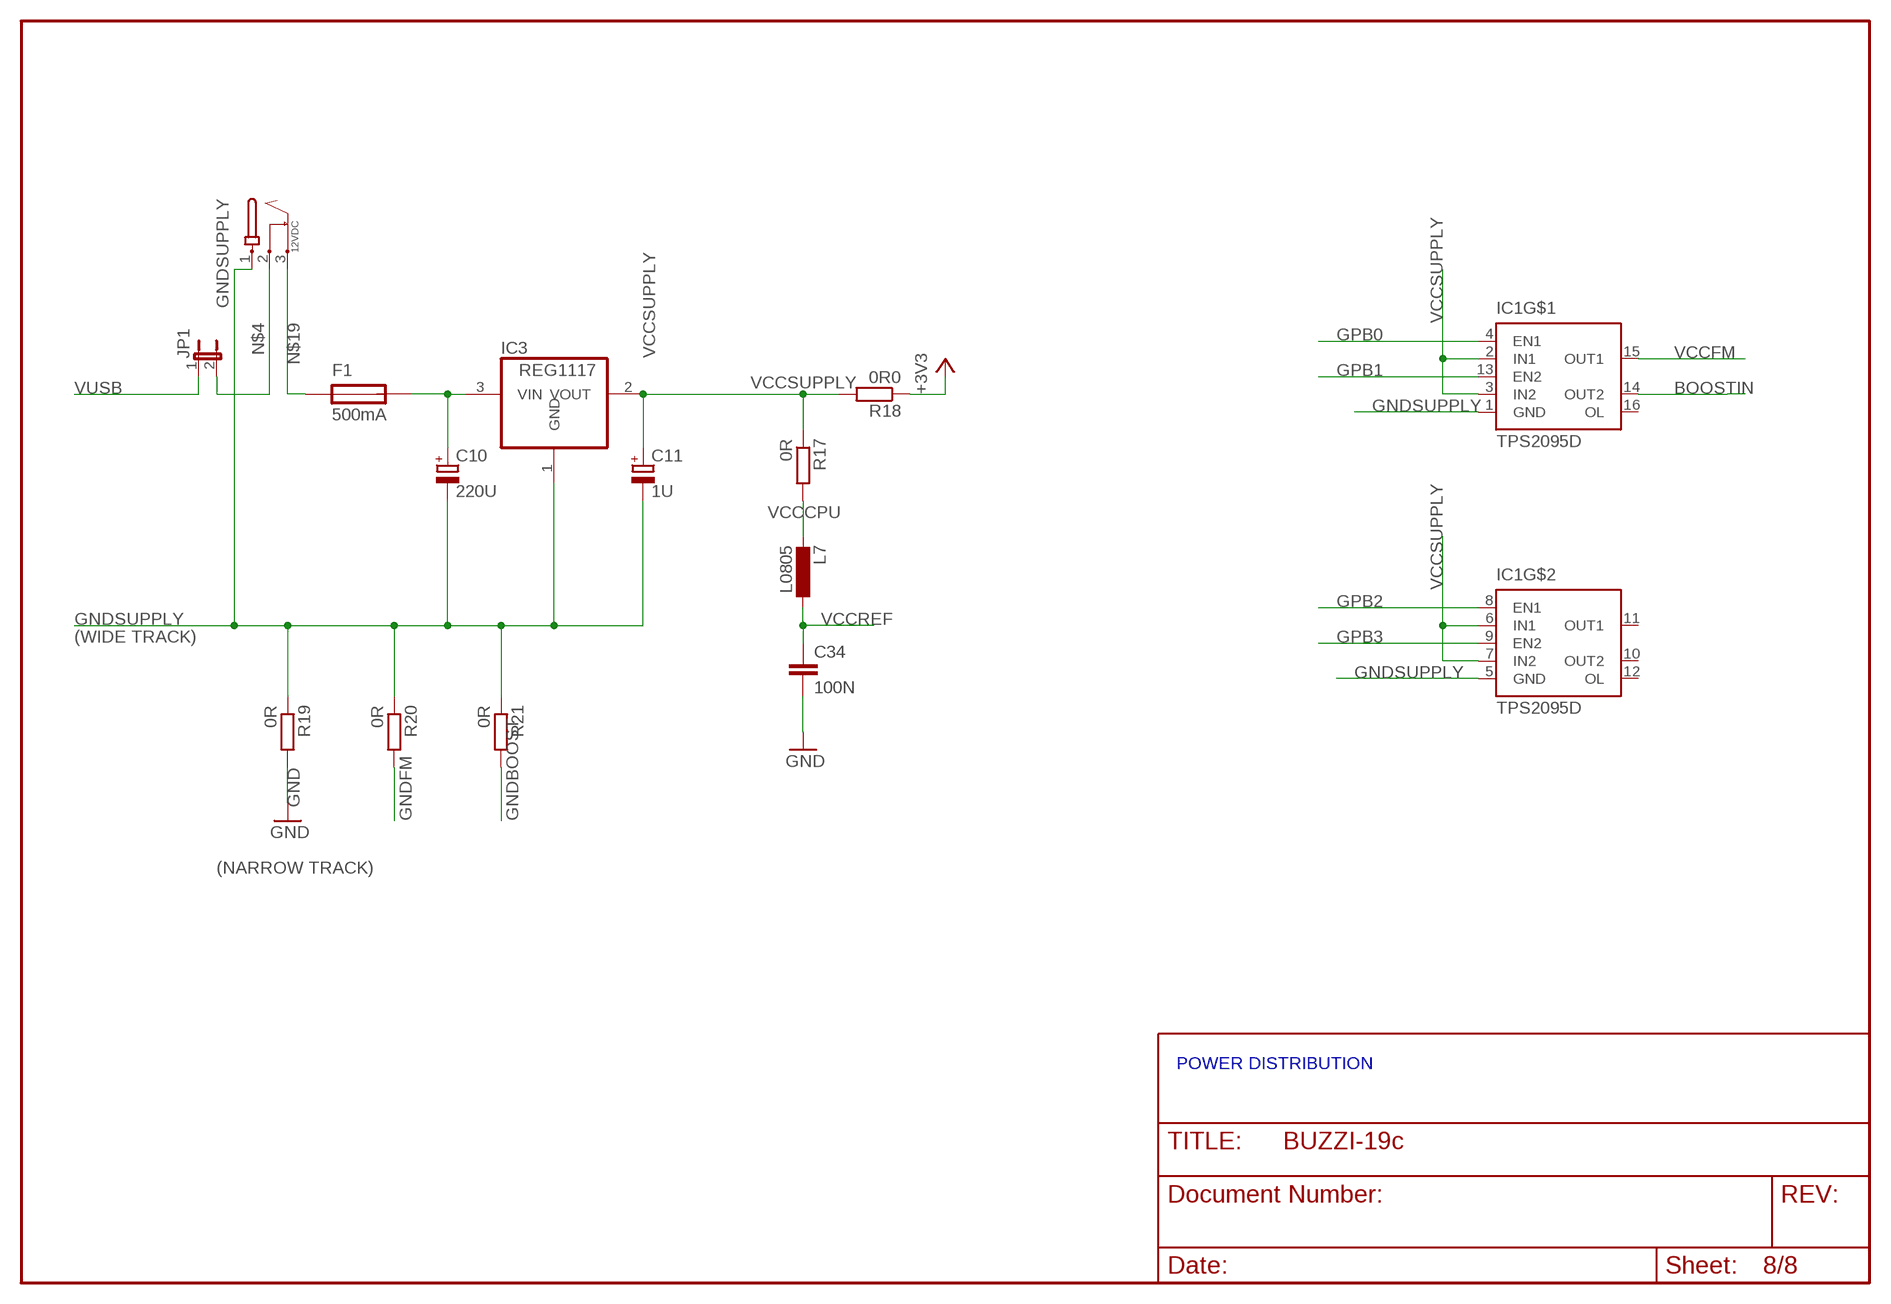
[diagram p7: schematic, sheet 8]

### Parts
12VDC  JACK-PMS  [JACK-PMS]
C10  220U  CPOL-EUCT7343  [CT7343]
C11  1U  CPOL-EUCT3528  [CT3528]
C34  100N  C-EUC0805  [C0805]
F1  500mA  FUSE  [C1206]
IC1  TPS2095D  [SO16]
IC3  REG1117  [SOT223]
JP1  JP1E  [JP1]
L7  L0805  [C0805]
R17  0R  R-EU_M0805  [M0805]
R18  0R0  R-EU_M0805  [M0805]
R19  0R  R-EU_M0805  [M0805]
R20  0R  R-EU_M0805  [M0805]
R21  0R  R-EU_M0805  [M0805]

### Nets
+3V3: R18.1 ; also sheet 1,2,5,7
BOOSTIN: IC1.14(OUT2) ; also sheet 3
GND: C34.2 R19.2 ; also sheet 1,2,5,6,7
GNDBOOST [supply]: R21.2 ; also sheet 3
GNDFM: R20.2 ; also sheet 1,4
GNDSUPPLY [supply]: 12VDC.1 C10.- C11.- IC1.1(GND) IC1.5(GND) IC3.1(GND) R19.1 R20.1 R21.1 ; also sheet 2
GPB0: IC1.4(EN1) ; also sheet 7
GPB1: IC1.13(EN2) ; also sheet 7
GPB2: IC1.8(EN1) ; also sheet 7
GPB3: IC1.9(EN2) ; also sheet 7
N$4 [supply]: 12VDC.2 JP1.2
N$19 [supply]: 12VDC.3 F1.1
V5V [supply]: C10.+ F1.2 IC3.3(VIN)
VCCCPU: L7.2 R17.2 ; also sheet 1
VCCFM: IC1.15(OUT1) ; also sheet 4
VCCREF: C34.1 L7.1 ; also sheet 1
VCCSUPPLY [supply]: C11.+ IC1.2(IN1) IC1.3(IN2) IC1.6(IN1) IC1.7(IN2) IC3.2(VOUT) R17.1 R18.2
VUSB [supply]: JP1.1 ; also sheet 2
Unconnected: IC1.10(OUT2) IC1.11(OUT1) IC1.12(OL) IC1.16(OL)

### Notes on the sheet
- (WIDE TRACK)
- (NARROW TRACK)
- POWER DISTRIBUTION

## Library data of the parts
12 D+ D- GN GN1 = testpad:TP
12VDC = POWER-IN:JACK-PMS
$$U$9 $$U$11 U$3-U$5 U$7 U$8 U$10 U$12-U$19 = turbod3:STITCHVIA
A1 CON LED1-LED3 VCC = led:LED: LED OSRAM: - CHIPLED LG R971, LG N971, LY N971, LG Q971, LY Q971, LO R971, LY R971 LH N974, LH R974 LS Q976, LO Q976, LY Q976 LO Q996 - Hyper CHIPLED LW Q18S LB Q993, LB Q99A, LB R99A - SideLED LS A670, LO A670, LY A670, LG A670, LP A670 LB A673, LV A673, LT A673, LW A673 LH A674 LY A675 LS A676, LA A676, LO A676, LY A676, LW A676 LS A679, LY A679, LG A679 - Hyper Micro SIDELED® LS Y876, LA Y876, LO Y876, LY Y876 LT Y87S - SmartLED LW L88C, LW L88S LB L89C, LB L89S, LG L890 LS L89K, LO L89K, LY L89K LS L896, LA L896, LO L896, LY L896 - TOPLED LS T670, LO T670, LY T670, LG T670, LP T670 LSG T670, LSP T670, LSY T670, LOP T670, LYG T670 LG T671, LOG T671, LSG T671 LB T673, LV T673, LT T673, LW T673 LH T674 LS T676, LA T676, LO T676, LY T676, LB T676, LH T676, LSB T676, LW T676 LB T67C, LV T67C, LT T67C, LS T67K, LO T67K, LY T67K, LW E67C LS E67B, LA E67B, LO E67B, LY E67B, LB E67C, LV E67C, LT E67C LW T67C LS T679, LY T679, LG T679 LS T770, LO T770, LY T770, LG T770, LP T770 LB T773, LV T773, LT T773, LW T773 LH T774 LS E675, LA E675, LY E675, LS T675 LS T776, LA T776, LO T776, LY T776, LB T776 LHGB T686 LT T68C, LB T68C - Hyper Mini TOPLED® LB M676 - Mini TOPLED Santana® LG M470 LS M47K, LO M47K, LY M47K Source: http://www.osram.convergy.de/
C1-C9 C13-C17 C19-C23 C26 C28-C39 C100-C107 = rcl:C-EU: CAPACITOR, European symbol
C10-C12 C18 C24 C25 C27 = rcl:CPOL-EU: POLARIZED CAPACITOR, European symbol
CON1 = turbod3:STEREOKLINKE
CON2 = turbod3:SDSLOT
D1 = diode:ES2D: DIODE super fast rectifier, 2 A
DCF = mini_din:MINI_DIN_4
F1 = turbod3:FUSE
IC1 = turbod3:TPS2095D
IC2 = turbod3:SAA6588
IC3 = burr-brown:REG1117: 800mA and 1A Low Dropout (LDO) Positive Regulator 1.8V, 2.5V, 2.85V, 3.3V, 5V, and Adj
IC4 = turbod3:TEA5880TS
IC5 = turbod3:MCP23016
IC6 = turbod3:TPS6104X
IC7 = turbod3:TC1270
IC8 = turbod3:VS1011E
IC9 = philips-5:LPC2148
JP1 = jumper:JP1E: JUMPER
JP2 = jumper:JP8Q: JUMPER
JP-BSL JP-DEB = jumper:JP1Q: JUMPER
JTAG1 = turbod3:ARM-JTAG
KEYBOARD = con-harting-ml:ML10: HARTING
L1-L7 = turbod3:L
Q1 Q2 Q4 = turbod3:CRYTAL: CRYSTAL
Q3 = crystal:CRYTAL: CRYSTAL
R1-R56 R100-R105 = rcl:R-EU_: RESISTOR, European symbol
RST SW1-SW4 = KEY_B:10XX
S1 = smd-special:SWS004: SMD Dip Switch 4 pol.
T1 = transistor:*-PNP-: PNP Transistror
T_GPIO = con-lstb:MA08-1: PIN HEADER
T_I2C1 = con-lstb:MA03-1: PIN HEADER
T_OLED = con-lstb:MA13-1: PIN HEADER
T_SPI1 = con-lstb:MA05-1: PIN HEADER
T_SPI2 = con-lstb:MA06-1: PIN HEADER
U$6 = turbod3:OLED_CALGARY_2
USB = turbod3:USBCONN
X1 = con-coax:BU-SMB-V: FEMALE SMB CONNECTOR Radiall distributor RS 112-2993

## Net classes
1 supply: width 0.5 mm